# EAGLE schematic MicroLab2_Group11 (EAGLE 9.6.2)
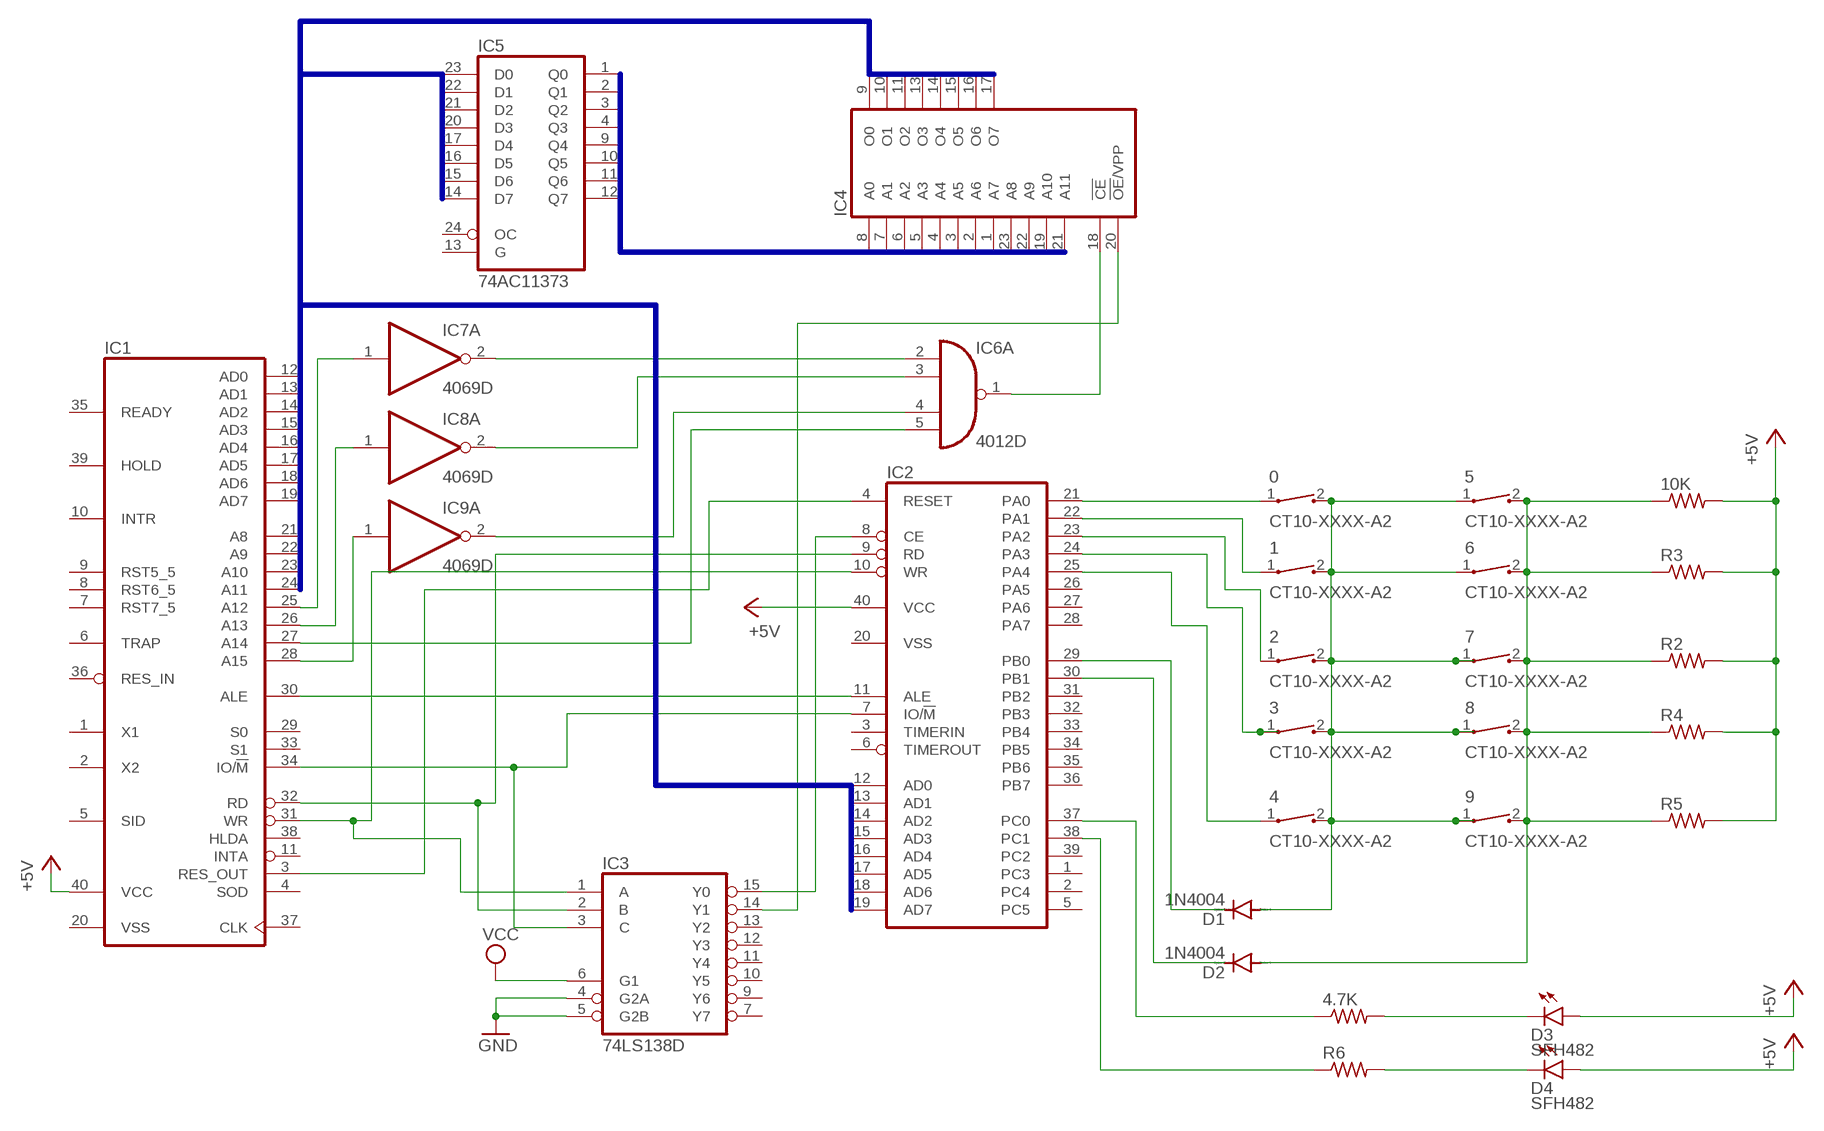
[diagram p0: schematic, sheet 1]

## Parts
0  CT10-XXXX-A2  [CT10-XXXX-A2]
1  CT10-XXXX-A2  [CT10-XXXX-A2]
2  CT10-XXXX-A2  [CT10-XXXX-A2]
3  CT10-XXXX-A2  [CT10-XXXX-A2]
4  CT10-XXXX-A2  [CT10-XXXX-A2]
4.7K  R-US_0204/2V  [0204V]
5  CT10-XXXX-A2  [CT10-XXXX-A2]
6  CT10-XXXX-A2  [CT10-XXXX-A2]
7  CT10-XXXX-A2  [CT10-XXXX-A2]
8  CT10-XXXX-A2  [CT10-XXXX-A2]
9  CT10-XXXX-A2  [CT10-XXXX-A2]
10K  R-US_0204/2V  [0204V]
D1  1N4004  [DO41-10]
D2  1N4004  [DO41-10]
D3  SFH482  [SFH482]
D4  SFH482  [SFH482]
IC1  8085  [DIL40]
IC2  8155  [DIL40]
IC3  74LS138D  [SO16]
IC4  2732  [DIL24]
IC5  74AC11373  [DIL24-6]
IC6  4012D  [SO14]
IC7  4069D  [SO14]
IC8  4069D  [SO14]
IC9  4069D  [SO14]
R2  R-US_0204/2V  [0204V]
R3  R-US_0204/2V  [0204V]
R4  R-US_0204/2V  [0204V]
R5  R-US_0204/2V  [0204V]
R6  R-US_0204/2V  [0204V]

## Nets
+5V: 10K.2 D3.A D4.A IC1.40(VCC) IC2.40(VCC) R2.2 R3.2 R4.2 R5.2
GND: IC3.4(G2A) IC3.5(G2B)
N$1: 0.1 IC2.21(PA0)
N$2: 0.2 1.2 2.2 3.2 4.2 5.1 6.1 7.1 8.1 9.1 D1.A
N$3: 5.2 6.2 7.2 8.2 9.2 D2.A R2.1 R3.1 R4.1 R5.1
N$4: 1.1 IC2.22(PA1)
N$5: 2.1 IC2.23(PA2)
N$6: 3.1 IC2.24(PA3)
N$7: 4.1 IC2.25(PA4)
N$8: D2.C IC2.30(PB1)
N$9: 10K.1
N$10: D1.C IC2.29(PB0)
N$11: 4.7K.1 IC2.37(PC0)
N$12: IC2.38(PC1) R6.1
N$13: 4.7K.2 D3.K(C)
N$14: D4.K(C) R6.2
N$15: IC2.8(CE) IC3.15(Y0)
N$16: IC1.32(RD) IC2.9(RD) IC3.2(B)
N$17: IC1.31(WR) IC2.10(WR) IC3.1(A)
N$18: IC1.34(IO/!M) IC2.7(IO/!M) IC3.3(C)
N$19: IC1.30(ALE) IC2.11(ALE)
N$20: IC1.3(RES_OUT) IC2.4(RESET)
N$21: IC1.25(A12) IC7.1(A:I)
N$22: IC3.14(Y1) IC4.20(!OE!/VPP)
N$23: IC1.26(A13) IC8.1(A:I)
N$24: IC1.28(A15) IC9.1(A:I)
N$25: IC1.27(A14) IC6.5(A:I3)
N$26: IC6.4(A:I2) IC9.2(A:O)
N$27: IC6.3(A:I1) IC8.2(A:O)
N$28: IC6.2(A:I0) IC7.2(A:O)
N$29: IC4.18(!CE) IC6.1(A:O)
VCC: IC3.6(G1)
Unconnected: IC1.1(X1) IC1.2(X2) IC1.4(SOD) IC1.5(SID) IC1.6(TRAP) IC1.7(RST7_5) IC1.8(RST6_5) IC1.9(RST5_5) IC1.10(INTR) IC1.11(INTA) IC1.12(AD0) IC1.13(AD1) IC1.14(AD2) IC1.15(AD3) IC1.16(AD4) IC1.17(AD5) IC1.18(AD6) IC1.19(AD7) IC1.21(A8) IC1.22(A9) IC1.23(A10) IC1.24(A11) IC1.29(S0) IC1.33(S1) IC1.35(READY) IC1.36(RES_IN) IC1.37(CLK) IC1.38(HLDA) IC1.39(HOLD) IC2.1(PC3) IC2.2(PC4) IC2.3(TIMERIN) IC2.5(PC5) IC2.6(TIMEROUT) IC2.12(AD0) IC2.13(AD1) IC2.14(AD2) IC2.15(AD3) IC2.16(AD4) IC2.17(AD5) IC2.18(AD6) IC2.19(AD7) IC2.26(PA5) IC2.27(PA6) IC2.28(PA7) IC2.31(PB2) IC2.32(PB3) IC2.33(PB4) IC2.34(PB5) IC2.35(PB6) IC2.36(PB7) IC2.39(PC2) IC3.7(Y7) IC3.9(Y6) IC3.10(Y5) IC3.11(Y4) IC3.12(Y3) IC3.13(Y2) IC4.1(A7) IC4.2(A6) IC4.3(A5) IC4.4(A4) IC4.5(A3) IC4.6(A2) IC4.7(A1) IC4.8(A0) IC4.9(O0) IC4.10(O1) IC4.11(O2) IC4.13(O3) IC4.14(O4) IC4.15(O5) IC4.16(O6) IC4.17(O7) IC4.19(A10) IC4.21(A11) IC4.22(A9) IC4.23(A8) IC5.1(Q0) IC5.2(Q1) IC5.3(Q2) IC5.4(Q3) IC5.9(Q4) IC5.10(Q5) IC5.11(Q6) IC5.12(Q7) IC5.13(G) IC5.14(D7) IC5.15(D6) IC5.16(D5) IC5.17(D4) IC5.20(D3) IC5.21(D2) IC5.22(D1) IC5.23(D0) IC5.24(OC) IC6.9(B:I0) IC6.10(B:I1) IC6.11(B:I2) IC6.12(B:I3) IC6.13(B:O) IC7.3(B:I) IC7.4(B:O) IC7.5(C:I) IC7.6(C:O) IC7.8(D:O) IC7.9(D:I) IC7.10(E:O) IC7.11(E:I) IC7.12(F:O) IC7.13(F:I) IC8.3(B:I) IC8.4(B:O) IC8.5(C:I) IC8.6(C:O) IC8.8(D:O) IC8.9(D:I) IC8.10(E:O) IC8.11(E:I) IC8.12(F:O) IC8.13(F:I) IC9.3(B:I) IC9.4(B:O) IC9.5(C:I) IC9.6(C:O) IC9.8(D:O) IC9.9(D:I) IC9.10(E:O) IC9.11(E:I) IC9.12(F:O) IC9.13(F:I)

## Buses
N$22
B$1

## Power pins joined to a net without a drawn wire
GND: IC3.8(GND) IC4.12(GND) IC5.5(GND) IC5.6(GND) IC5.7(GND) IC5.8(GND)
VCC: IC3.16(VCC) IC4.24(VCC) IC5.18(VCC) IC5.19(VCC)
VDD: IC6.14(P:VDD) IC7.14(P:VDD) IC8.14(P:VDD) IC9.14(P:VDD)
VSS: IC1.20(VSS) IC2.20(VSS) IC6.7(P:VSS) IC7.7(P:VSS) IC8.7(P:VSS) IC9.7(P:VSS)

## Library data of the parts
0 1-9 = switch-coto:CT10-XXXX-: CT10 Series Molded Switch Source: www.cotorelay.com .. Coto_Technology__CT10-1530-G1.pdf
4.7K 10K R2-R6 = rcl:R-US_: RESISTOR, American symbol; SPICEPREFIX: R
D1 D2 = diode:1N4004: DIODE general purpose rectifier, 1 A
D3 D4 = led:SFH482: IR LED infrared emitting diode, Infineon
IC1 = micro-intel:8085: MICROCOMPUTER/PERIPHERAL DEVICE; OC_FARNELL: unknown; OC_NEWARK: unknown
IC2 = micro-intel:8155: MICROCOMPUTER/PERIPHERAL DEVICE; OC_FARNELL: unknown; OC_NEWARK: unknown
IC3 = 74xx-us:74*138: 3-line to 8-line DECODER/DEMULTIPLEXER
IC4 = memory:2732: MEMORY
IC5 = 74ac-logic:74AC11373: Octal transparent D-type LATCH, 3-state
IC6 = 40xx:4012: Dual 4-input NAND
IC7-IC9 = 40xx:4069: Hex INVERTER